# Altium schematic sheet SSRSheet.SchDoc
size A2; SheetNumber: 1; SheetTotal: 1
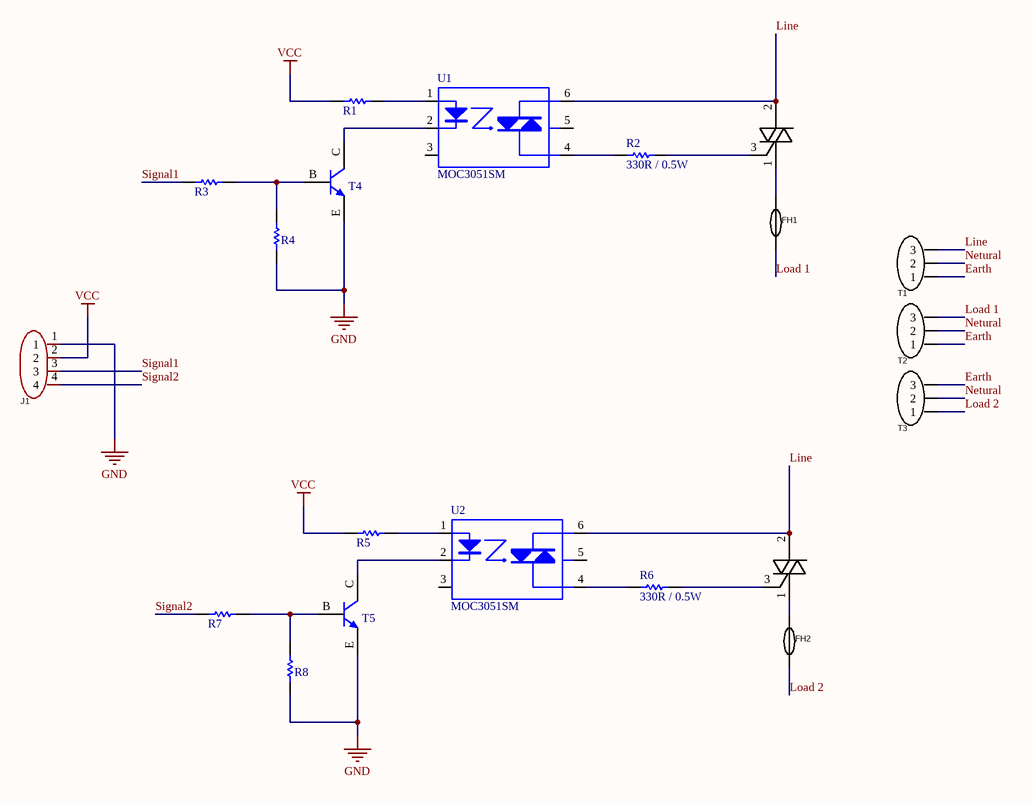
[diagram p0: SSRSheet.SchDoc]

## Parts
FH1  XF-154  [FUSE-SMD_L10.5-W5.1]  (value not drawn)
FH2  XF-154  [FUSE-SMD_L10.5-W5.1]  (value not drawn)
J1  Header 4P*2mm  [CONN-TH_4P-P2.00_HX20020-4A_2]  (value not drawn)
Q1  BT136S-800E,118  [TO-252-3_L6.6-W6.1-P4.57-LS9.9-BR-CW]  (value not drawn)
Q2  BT136S-800E,118  [TO-252-3_L6.6-W6.1-P4.57-LS9.9-BR-CW]  (value not drawn)
R1  330R  [R0402]  (value not drawn)
R2  330R / 0.5W  [R1210]
R3  4.7kR  [R0402]  (value not drawn)
R4  10kR  [R0402]  (value not drawn)
R5  330R  [R0402]  (value not drawn)
R6  330R / 0.5W  [R1210]
R7  4.7kR  [R0402]  (value not drawn)
R8  10kR  [R0402]  (value not drawn)
T1  WJ45C-B-9.5-3P  [CONN-TH_3P-P9.50_WJ45C-B-3P]  (value not drawn)
T2  WJ45C-B-9.5-3P  [CONN-TH_3P-P9.50_WJ45C-B-3P]  (value not drawn)
T3  WJ45C-B-9.5-3P  [CONN-TH_3P-P9.50_WJ45C-B-3P]  (value not drawn)
T4  MMBT3904 Transistor  [MMBT3904]  (value not drawn)
T5  MMBT3904 Transistor  [MMBT3904]  (value not drawn)
U1  MOC3051SM  [OPTOTRIAC_SMD_6PIN]
U2  MOC3051SM  [OPTOTRIAC_SMD_6PIN]

## Nets
GND: J1.1 R4.1 R8.1 T4.E T5.E
VCC: J1.2 R1.1 R5.1
Earth: T1.1 T2.1 T3.3
Line: Q1.2(T2) Q2.2(T2) T1.3 U1.6 U2.6
Load 1: FH1.1 T2.3
Load 2: FH2.1 T3.1
Netural: T1.2 T2.2 T3.2
Signal1: J1.3 R3.1
Signal2: J1.4 R7.1
NetFH1_2: FH1.2 Q1.1(T1)
NetFH2_2: FH2.2 Q2.1(T1)
NetQ1_3: Q1.3(G) R2.1
NetQ2_3: Q2.3(G) R6.1
NetR1_2: R1.2 U1.1
NetR2_2: R2.2 U1.4
NetR3_2: R3.2 R4.2 T4.B
NetR5_2: R5.2 U2.1
NetR6_2: R6.2 U2.4
NetR7_2: R7.2 R8.2 T5.B
NetT4_C: T4.C U1.2
NetT5_C: T5.C U2.2

Not connected (* = marked no-connect by the designer): U1 3(NC_1) 5(NC_2); U2 3(NC_1) 5(NC_2)

## Library data of the parts
FH1 FH2 = XF-154: C41371861; Manufacturer: XFCN(兴飞); Add into BOM: yes; Symbol: XF-154; Device: XF-154; LCSC Part Name: XF-154; Supplier Part: C41371861; Manufacturer Part: XF-154; Supplier Footprint: SMD; JLCPCB Part Class: Extended Part; Datasheet: https://atta.szlcsc.com/upload/public/pdf/source/20240828/54540296E604CB321541E8B6C3E496A3.pdf; Supplier: LCSC; Convert to PCB: yes
J1 = ZX-HY2.0-4PZZ: C541313; Manufacturer: Megastar(兆星); Add into BOM: yes; Pins Structure: 1x4P; Pitch: 2mm; Reference Series: HY; Number of PINs Per Row: 4; Current Rating (Max): 2A; Rated Voltage (Max): 250V; Flame Retardant Rating: UL94V-0; Z-Height of the Board: 8mm; X-Length of Bottom Edge on Board (Spacing Line): 10mm; Y-Width of Bottom Edge on Board: 5.1mm; Symbol: ZX-HY2.0-4PZZ; Device: ZX-HY2.0-4PZZ; LCSC Part Name: 1x4P 间距:2mm 直插 系列:HY 配套胶壳型号：ZX-HY2.0-4PJK 配套端子型号：ZX-HY2.0-DZ 配套杜邦线型号：ZX-HY2.0-4PBXC; Supplier Part: C7429580; Manufacturer Part: ZX-HY2.0-4PZZ; Supplier Footprint: 插件,P=2mm; JLCPCB Part Class: Extended Part; Datasheet: https://atta.szlcsc.com/upload/public/pdf/source/20241025/5A7CD93910E89EF197073334521200FC.pdf; Supplier: LCSC; Convert to PCB: yes; Mounting Style: Direct Insert; Number of Pins: 4P; Number of Rows: 1; Row Spacing: -; Contact Material: Brass; Contact Plating: Tin; Operating Temperature Range: -25℃~+85℃; Plastic Material: -; Supplementary Features: -; Colour: White
Q1 Q2 = BT136S-800E,118: C581422; Manufacturer: WeEn(瑞能); Add into BOM: yes; Gate Trigger   Voltage (Vgt): 1.5V; Holding Current (Ih): 15mA; Peak Repetitive Off?State Voltage (Vdrm): 800V; Gate Trigger Current(Igt): 10mA; RMS On-State Current(It (rms)): 4A; Symbol: BT136S-800E,118; Device: BT136S-800E,118; LCSC Part Name: BT136S-800E,118; Supplier Part: C581422; Manufacturer Part: BT136S-800E,118; Supplier Footprint: DPAK; JLCPCB Part Class: Extended Part; Datasheet: https://atta.szlcsc.com/upload/public/pdf/source/20200604/C581422_C791797B81F6B31C38BE664CA17CBB1A.pdf; Supplier: LCSC; Convert to PCB: yes; SCR Type: -; Operating Temperature: -
R1 R5 = 0402 Resistor: C159971
R2 R6 = AC1210FR-07330RL: C2933817; Manufacturer: Yageo; Power Rating: 500mW; Tolerance: 1%; Voltage Rating: 200V; Temperature Coefficient: 100ppm/°C; Supplier 1: Mouser; Manufacturer Part Number: AC1210FR-07330RL; RoHS: Yes; Category: Chip SMD Resistors; Stock 1: 2010; Pricing 1: 1=0.30000, 10=0.19100, 50=0.19100, 100=0.06200, 1000=0.04300, 10000=0.03100 (USD); Case/Package: 1210; Case Code (Imperial): 1210; Case Code (Metric): 3225; Min Operating Temperature: -55°C; Max Operating Temperature: 155°C; Packaging: Tape and Reel; Resistance: 330R; Number of Terminations: 2; Termination: SMD/SMT; Max Power Dissipation: 500mW; Features: Moisture Resistant,Automotive AEC-Q200; Series: AC; Length: 0.122inch; Width: 2.6mm; Height: 0.024inch; RoHS Compliant: Yes; ComponentLink1URL: http://www.mouser.com/ds/2/447/yageodocoutput-1111992.pdf?src-supplier=Mouser; ComponentLink1Description: http://www.mouser.com/ds/2/447/yageodocoutput-1111992.pdf?src-supplier=Mouser; ComponentLink2URL: http://www.yageo.com/NewPortal/yageodocoutput?fileName=/pdf/R-Chip/PYu-AC_51_RoHS_L_6.pdf&src-supplier=Digi-Key; ComponentLink2Description: http://www.yageo.com/NewPortal/yageodocoutput?fileName=/pdf/R-Chip/PYu-AC_51_RoHS_L_6.pdf&src-supplier=Digi-Key; Supplier Part Number 1: 603-AC1210FR-07330RL
R3 R7 = 0402 Resistor: C105871
R4 R8 = 0402 Resistor: C60490
T1-T3 = WJ45C-B-9.5-3P: C8442; Manufacturer: KANGNEX(康奈克斯电气); Symbol: WJ45C-B-3P; Add into BOM: yes; Barrier Type: 两面; Pitch: 9.5mm; Structure: 1x3P; Pin Location: 中脚; Current Rating (Max): 32A; Voltage Rating (Max): 750V; Wire Gauge - AWG: 12~22; Wire Gauge - mm2: 4; Color: Black; Number of PINs Per Row: 3; Device: WJ45C-B-9.5-3P; LCSC Part Name: 9.5mm 1x3P 每排P数:3 排数:1 直针 中脚; Supplier Part: C8442; Manufacturer Part: WJ45C-B-9.5-3P; Supplier Footprint: 插件,P=9.5mm; JLCPCB Part Class: Extended Part; Datasheet: https://atta.szlcsc.com/upload/public/pdf/source/20191225/C8442_FBE59D2F29844B0ABF8A0A98E5C59968.pdf; Supplier: LCSC; Convert to PCB: yes; Mounting Style: 直针; Number of Pins: 3P; Number of Rows: 1; Operating Temperature Range: -40℃~+105℃
T4 T5 = MMBT3904 Transistor: C181119; Created By: NourAldin
U1 U2 = MOC3051SM: C22373368; Manufacturer: ON Semiconductor / Fairchild; Forward Current: 60mA; Forward Voltage: 1.18V; Number of Channels: 1; Nominal Input Voltage: 1.15V; Max Input Voltage: 1.5V; Reverse Breakdown Voltage: 3V; Power Dissipation: 330mW; Hold Current: 220uA; Isolation Voltage: 7.5kV; Approvals: UR; Supplier 1: Mouser; Manufacturer Part Number: MOC3051SM; RoHS: Yes; Category: Optocouplers; Stock 1: 1665; Pricing 1: 1=1.20000, 10=0.76100, 50=0.76100, 100=0.56400, 1000=0.40000, 10000=0.38200 (USD); Mount: Surface Mount; Case/Package: SMD/SMT; Number of Pins: 6; Weight: 0.81g; Min Operating Temperature: -40°C; Max Operating Temperature: 85°C; Packaging: Bulk; Package Quantity: 1000; Number of Elements: 1; Number of Circuits: 1; Series: -; Isolation Voltage-Max: 7.5kV; Radiation Hardening: No; Lead Free: Lead Free; RoHS Compliant: Yes; ComponentLink1URL: https://datasheet.ciiva.com/8097/moc3052m-8097782.pdf?src-supplier=Avnet; ComponentLink1Description: https://datasheet.ciiva.com/8097/moc3052m-8097782.pdf?src-supplier=Avnet; ComponentLink2URL: https://datasheet.ciiva.com/17022/moc3051m-17022507.pdf?src-supplier=Future+Electronics; ComponentLink2Description: https://datasheet.ciiva.com/17022/moc3051m-17022507.pdf?src-supplier=Future+Electronics; Supplier Part Number 1: 512-MOC3051SM